# EAGLE design Inverter (EAGLE 7.5.0)
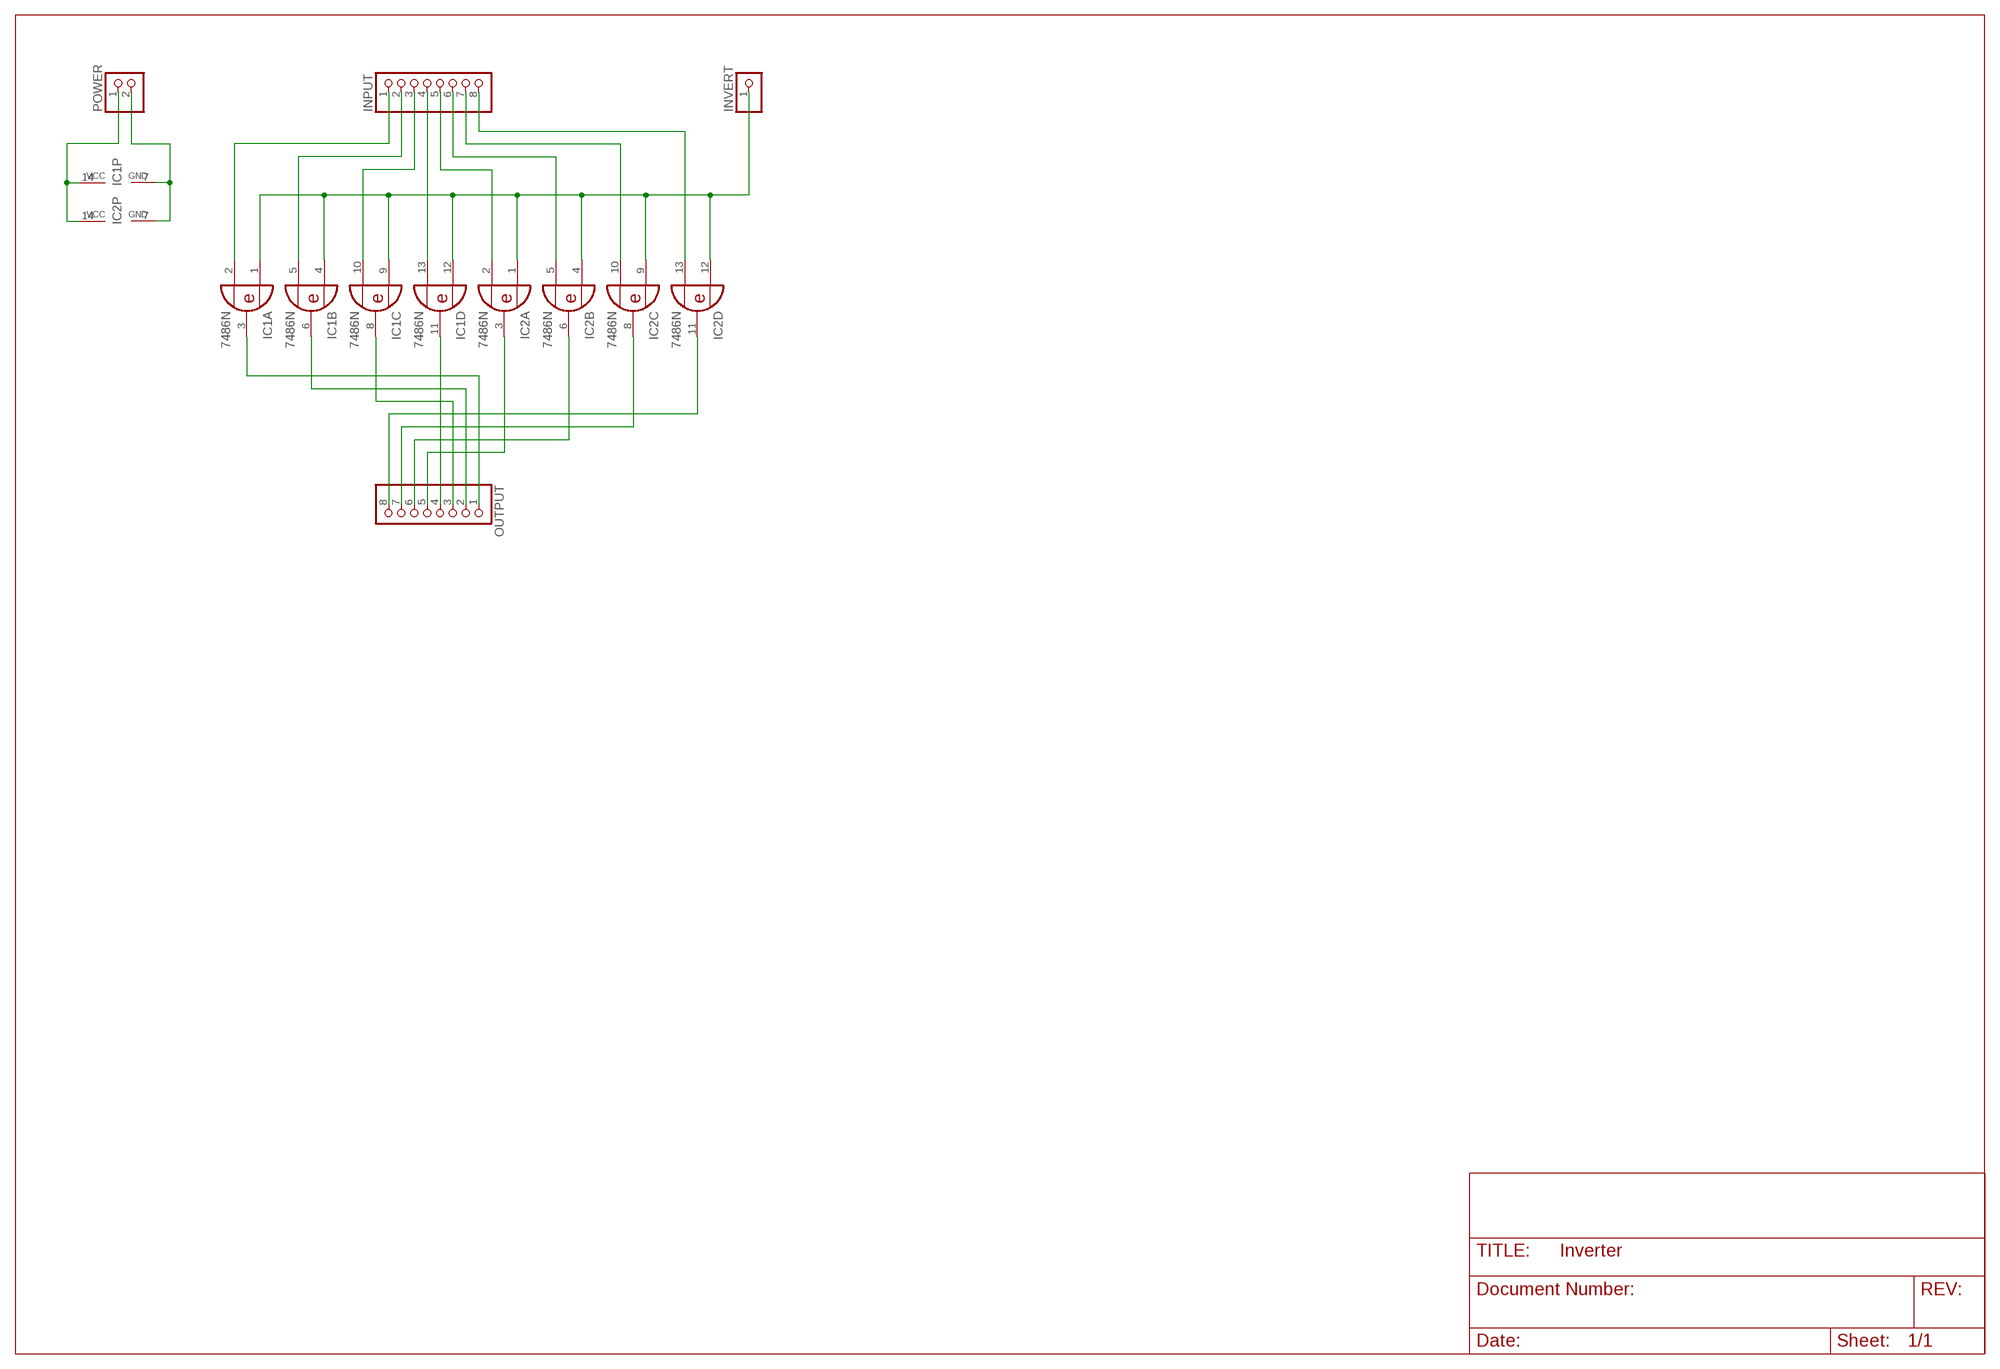
[diagram p0: schematic, sheet 1]

## Parts
IC1  7486N  [DIL14]
IC2  7486N  [DIL14]
INPUT  PINHD-1X8  [1X08]
INVERT  PINHD-1X1  [1X01]
OUTPUT  PINHD-1X8  [1X08]
POWER  PINHD-1X2  [1X02]

## Nets
N$1: IC1.2(A:I1) INPUT.1
N$2: IC1.5(B:I1) INPUT.2
N$3: IC1.10(C:I1) INPUT.3
N$4: IC1.13(D:I1) INPUT.4
N$5: IC2.2(A:I1) INPUT.5
N$6: IC2.5(B:I1) INPUT.6
N$7: IC2.10(C:I1) INPUT.7
N$8: IC2.13(D:I1) INPUT.8
N$9: IC1.1(A:I0) IC1.4(B:I0) IC1.9(C:I0) IC1.12(D:I0) IC2.1(A:I0) IC2.4(B:I0) IC2.9(C:I0) IC2.12(D:I0) INVERT.1
N$10: IC1.3(A:O) OUTPUT.1
N$11: IC1.6(B:O) OUTPUT.2
N$12: IC1.8(C:O) OUTPUT.3
N$13: IC1.11(D:O) OUTPUT.4
N$14: IC2.3(A:O) OUTPUT.5
N$15: IC2.6(B:O) OUTPUT.6
N$16: IC2.8(C:O) OUTPUT.7
N$17: IC2.11(D:O) OUTPUT.8
N$18: IC1.14(P:VCC) IC2.14(P:VCC) POWER.1
N$19: IC1.7(P:GND) IC2.7(P:GND) POWER.2

## Library data of the parts
IC1 IC2 = 74xx-eu:74*86: Quad 2-input EXCLUSIVE-OR (XOR) gate
INPUT OUTPUT = pinhead:PINHD-1X8: PIN HEADER
INVERT = pinhead:PINHD-1X1: PIN HEADER
POWER = pinhead:PINHD-1X2: PIN HEADER

## Board
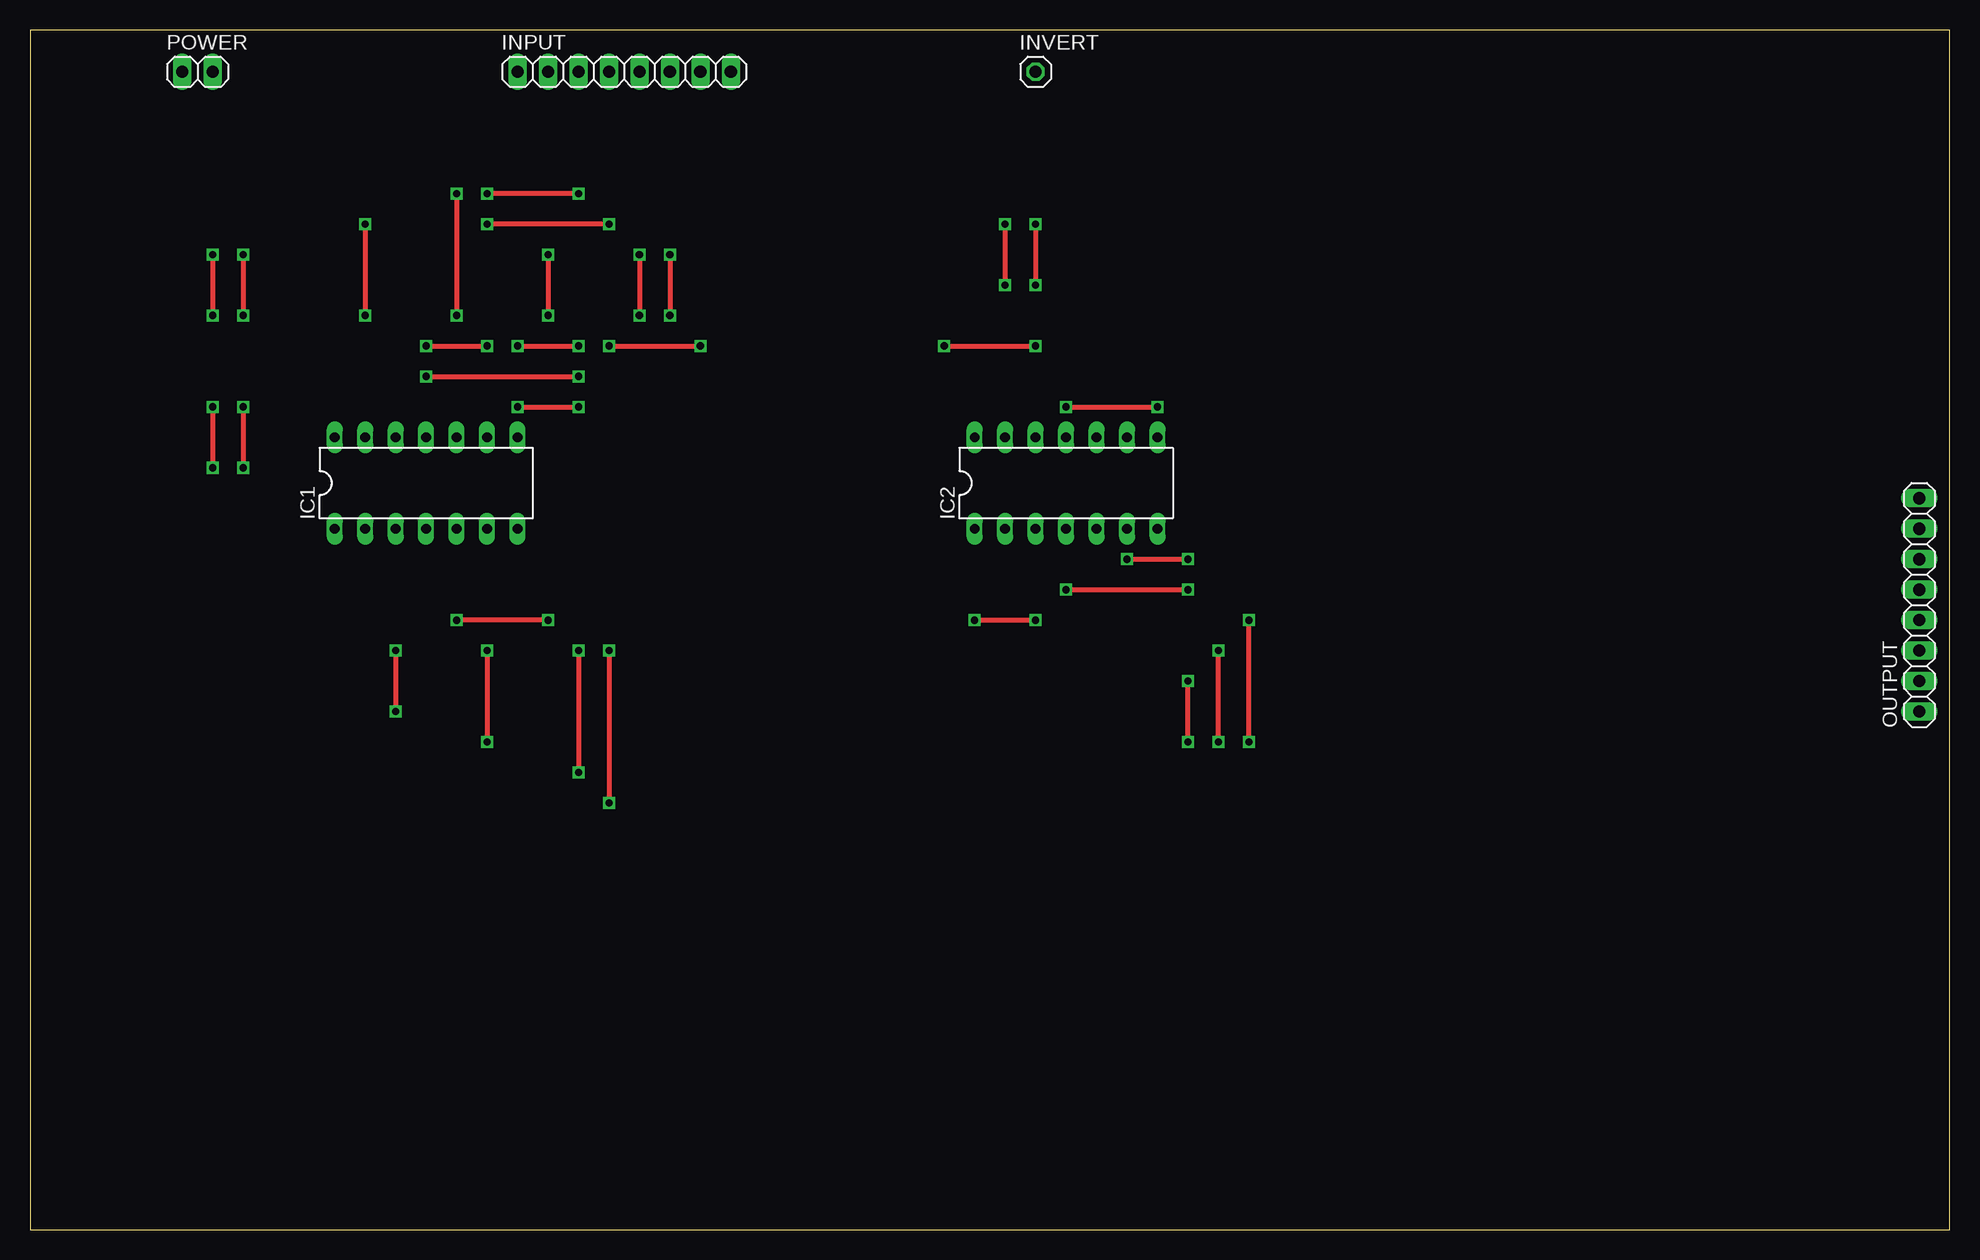
[diagram p1: board, top side]
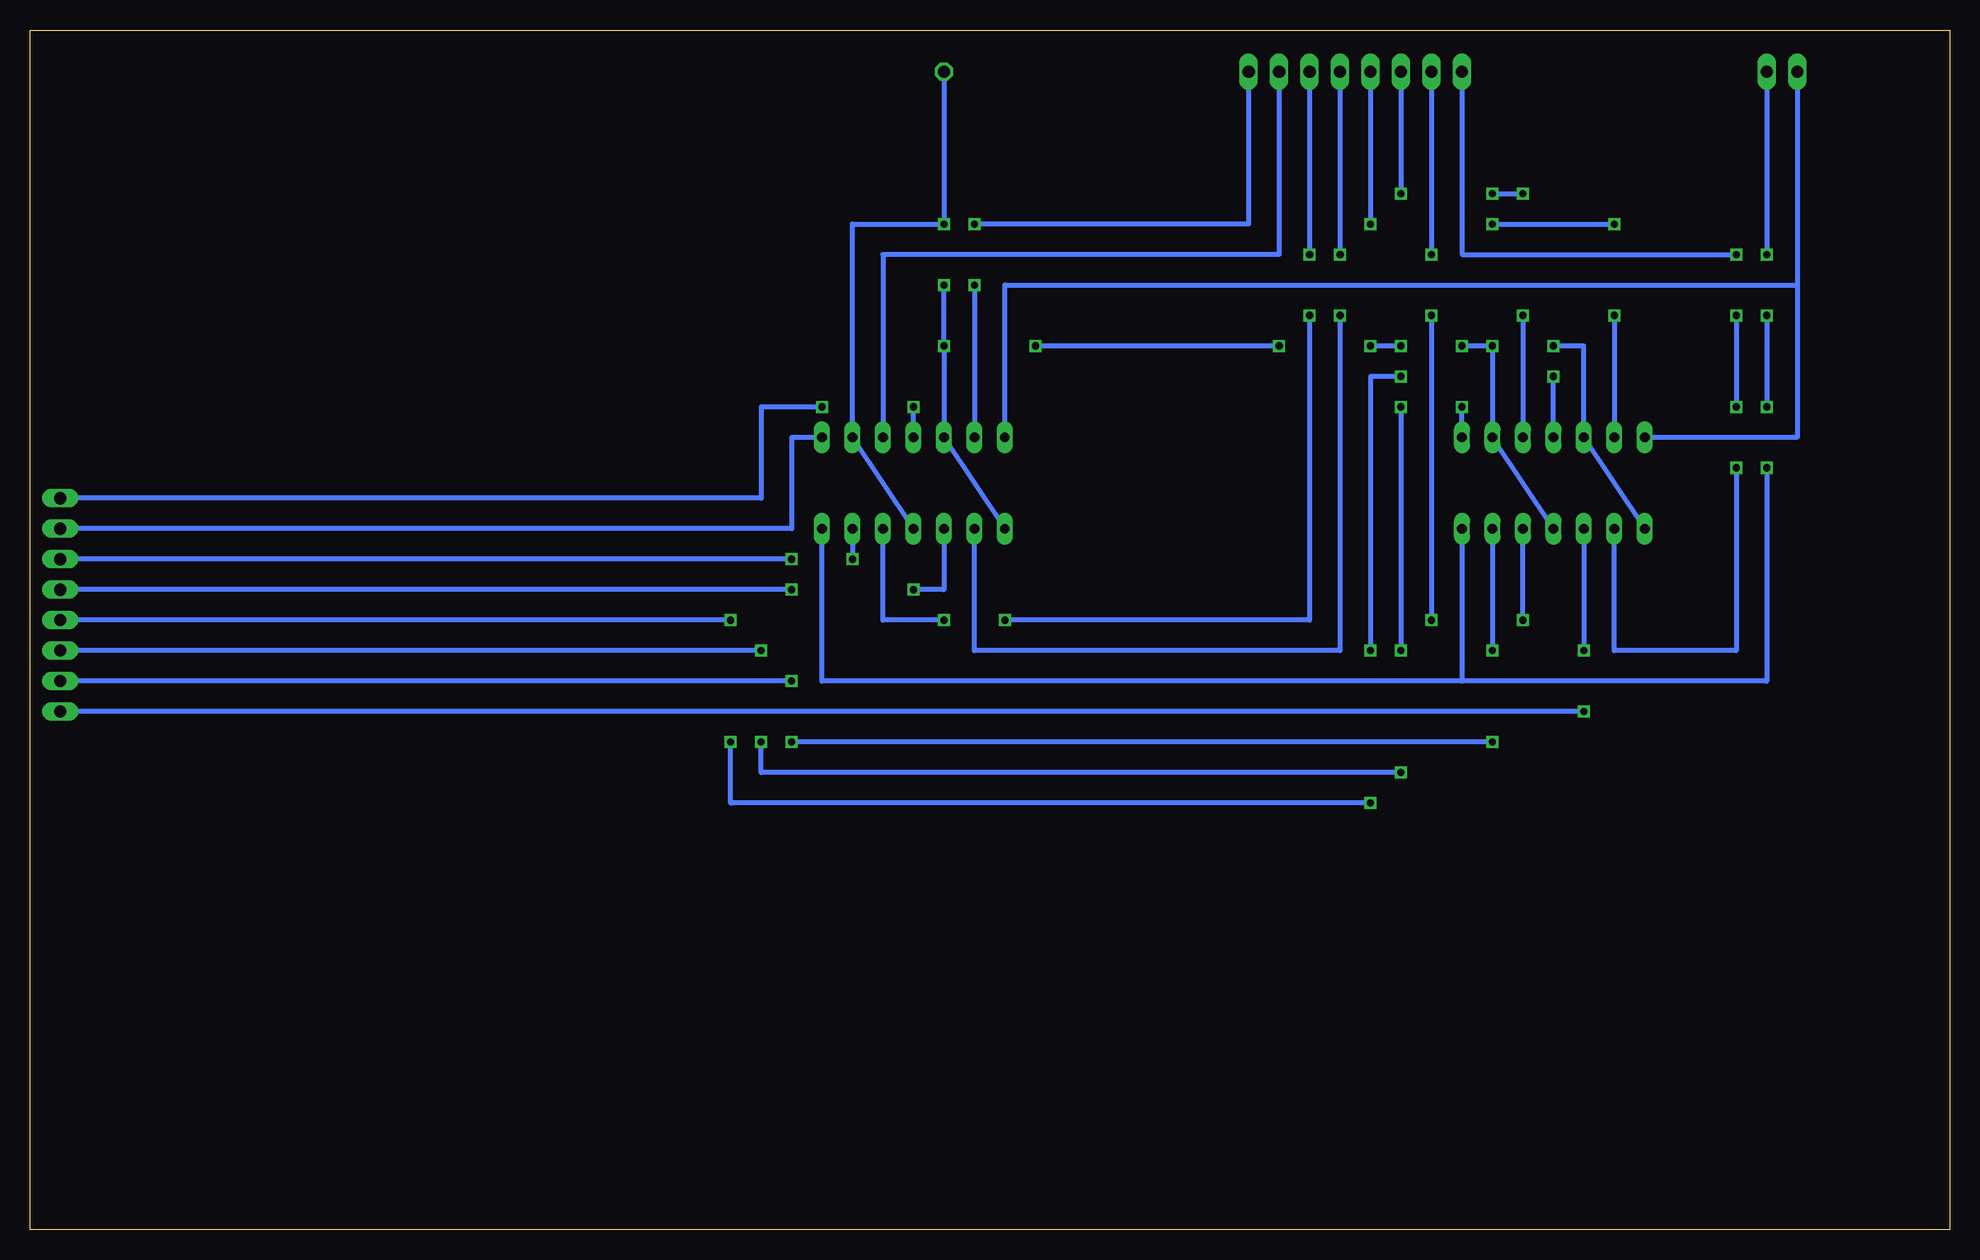
[diagram p2: board, bottom side, seen from below]

Size 160 x 100 mm. Coordinates in mm from the lower left corner, seen from the top.
Outline: 0,0 160,0 160,100 0,100 0,0
Copper layers (1*16): Top 0.035mm / dielectric 1.5mm / Bottom 0.035mm
Design rules "default": minimum track width 10mil, minimum drill 24mil, track to track 8mil, track to pad 8mil, pad to pad 8mil, via to via 8mil, smd to smd 8mil, copper to edge 40mil, drill to drill 8mil, minimum pad ring 10mil, minimum via ring 8mil, stop-mask expansion 4mil, vias tented up to drill 0mil, thermal gap 10mil

### Footprints (pad centres in the part's own frame; a part is rotated, then mirrored left to right if it is on the bottom)
DIL14 = drill 0.813 long: 1 -7.62,-3.81; 2 -5.08,-3.81; 3 -2.54,-3.81; 4 0,-3.81; 5 2.54,-3.81; 6 5.08,-3.81; 7 7.62,-3.81; 8 7.62,3.81; 9 5.08,3.81; 10 2.54,3.81; 11 0,3.81; 12 -2.54,3.81; 13 -5.08,3.81; 14 -7.62,3.81
1X08 = drill 1.016 long: 1 -8.89,0; 2 -6.35,0; 3 -3.81,0; 4 -1.27,0; 5 1.27,0; 6 3.81,0; 7 6.35,0; 8 8.89,0
1X01 = drill 1.016 octagon: 1 0,0
1X02 = drill 1.016 long: 1 -1.27,0; 2 1.27,0

### Placement (x,y rotation side)
IC1  33.02,62.23 0 top
IC2  86.36,62.23 0 top
INPUT  49.53,96.52 0 top
INVERT  83.82,96.52 0 top
OUTPUT  157.48,52.07 90 top
POWER  13.97,96.52 0 top

### Tracks (layer width: path | path; a pad name or v marks a point on that pad's centre or on a via)
N$1  (via drill 0.6)
  Top 0.406: v17.78,81.28 v17.78,76.2 | v17.78,68.58 v17.78,63.5
  Bottom 0.406: INPUT.1 40.64,81.28 v17.78,81.28 | v17.78,76.2 v17.78,68.58 | v17.78,63.5 17.78,48.26 27.94,48.26 IC1.2
N$2  (via drill 0.6)
  Top 0.406: v43.18,81.28 v43.18,76.2 | v43.18,50.8 v35.56,50.8
  Bottom 0.406: INPUT.2 v43.18,81.28 | v43.18,76.2 v43.18,50.8 | v35.56,50.8 IC1.5
N$3  (via drill 0.6)
  Top 0.406: v45.72,86.36 v38.1,86.36 | v35.56,86.36 v35.56,76.2
  Bottom 0.406: INPUT.3 v45.72,86.36 | v38.1,86.36 v35.56,86.36 | v35.56,76.2 IC1.10
N$4  (via drill 0.6)
  Top 0.406: v48.26,83.82 v38.1,83.82 | v27.94,83.82 v27.94,76.2
  Bottom 0.406: INPUT.4 v48.26,83.82 | v38.1,83.82 v27.94,83.82 | v27.94,76.2 IC1.13
N$5  (via drill 0.6)
  Top 0.406: v50.8,81.28 v50.8,76.2
  Bottom 0.406: INPUT.5 v50.8,81.28 | v50.8,76.2 50.8,48.26 81.28,48.26 IC2.2
N$6  (via drill 0.6)
  Top 0.406: v53.34,81.28 v53.34,76.2 | v78.74,50.8 v83.82,50.8
  Bottom 0.406: INPUT.6 v53.34,81.28 | v53.34,76.2 53.34,50.8 v78.74,50.8 | v83.82,50.8 88.9,50.8 IC2.5
N$7
  Bottom 0.406: INPUT.7 55.88,81.28 88.9,81.28 IC2.10
N$8  (via drill 0.6)
  Top 0.406: v81.28,83.82 v81.28,78.74
  Bottom 0.406: INPUT.8 58.42,83.82 v81.28,83.82 | v81.28,78.74 IC2.13
N$9  (via drill 0.6)
  Top 0.406: v83.82,83.82 v83.82,78.74 | v33.02,73.66 v38.1,73.66 | v40.64,73.66 v45.72,73.66 | v48.26,73.66 v55.88,73.66 | v76.2,73.66 v83.82,73.66
  Bottom 0.406: INVERT.1 v83.82,83.82 91.44,83.82 IC2.9 IC2.4 | IC2.1 IC2.12 v83.82,73.66 v83.82,78.74 | v33.02,73.66 30.48,73.66 IC1.12 IC1.1 | v40.64,73.66 v38.1,73.66 IC1.9 IC1.4 | v45.72,73.66 v48.26,73.66 | v55.88,73.66 v76.2,73.66
N$10  (via drill 0.6)
  Top 0.406: v30.48,48.26 v30.48,43.18
  Bottom 0.406: IC1.3 v30.48,48.26 | v30.48,43.18 OUTPUT.1
N$11  (via drill 0.6)
  Top 0.406: v38.1,48.26 v38.1,40.64 | v96.52,40.64 v96.52,45.72
  Bottom 0.406: IC1.6 v38.1,48.26 | v38.1,40.64 v96.52,40.64 | v96.52,45.72 OUTPUT.2
N$12  (via drill 0.6)
  Top 0.406: v40.64,68.58 v45.72,68.58 | v45.72,48.26 v45.72,38.1 | v99.06,40.64 v99.06,48.26
  Bottom 0.406: IC1.8 v40.64,68.58 | v45.72,68.58 v45.72,48.26 | v45.72,38.1 99.06,38.1 v99.06,40.64 | v99.06,48.26 OUTPUT.3
N$13  (via drill 0.6)
  Top 0.406: v33.02,71.12 v45.72,71.12 | v48.26,48.26 v48.26,35.56 | v101.6,40.64 v101.6,50.8
  Bottom 0.406: IC1.11 v33.02,71.12 | v45.72,71.12 48.26,71.12 v48.26,48.26 | v48.26,35.56 101.6,35.56 v101.6,40.64 | v101.6,50.8 OUTPUT.4
N$14  (via drill 0.6)
  Top 0.406: v86.36,53.34 v96.52,53.34
  Bottom 0.406: IC2.3 83.82,53.34 v86.36,53.34 | v96.52,53.34 OUTPUT.5
N$15  (via drill 0.6)
  Top 0.406: v91.44,55.88 v96.52,55.88
  Bottom 0.406: IC2.6 v91.44,55.88 | v96.52,55.88 OUTPUT.6
N$16
  Bottom 0.406: IC2.8 96.52,66.04 96.52,58.42 OUTPUT.7
N$17  (via drill 0.6)
  Top 0.406: v86.36,68.58 v93.98,68.58
  Bottom 0.406: IC2.11 v86.36,68.58 | v93.98,68.58 99.06,68.58 99.06,60.96 OUTPUT.8
N$18
  Bottom 0.406: POWER.1 12.7,78.74 | 12.7,78.74 12.7,66.04 IC1.14 | IC2.14 78.74,78.74 12.7,78.74
N$19  (via drill 0.6)
  Top 0.406: v15.24,81.28 v15.24,76.2 | v15.24,68.58 v15.24,63.5
  Bottom 0.406: POWER.2 v15.24,81.28 | v15.24,76.2 v15.24,68.58 | v15.24,63.5 15.24,45.72 40.64,45.72 | 40.64,45.72 93.98,45.72 IC2.7 | IC1.7 40.64,45.72